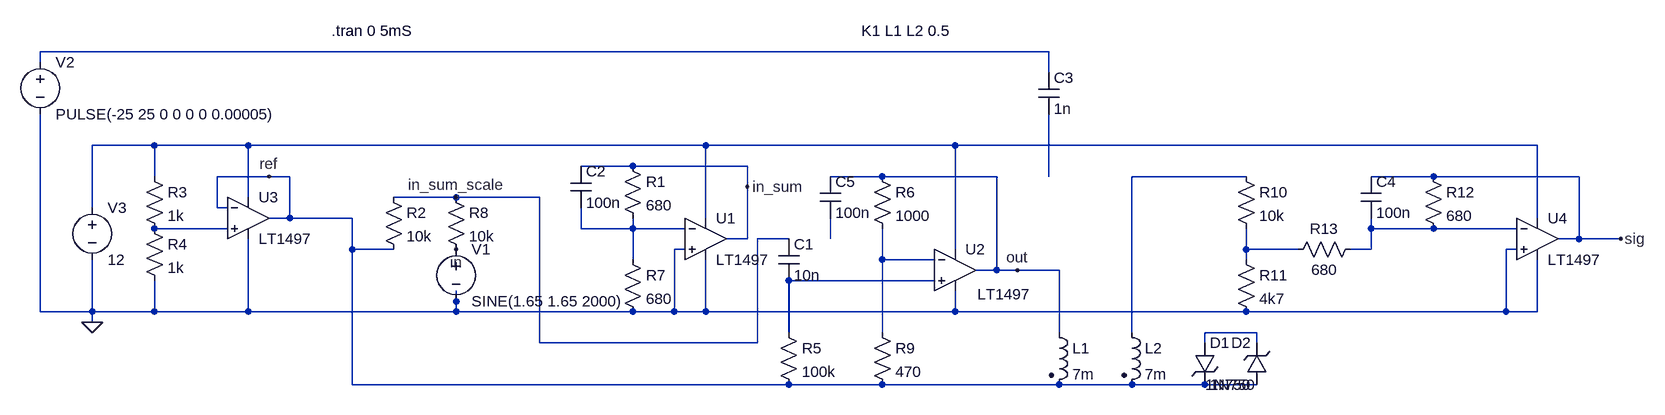
[diagram p0: schematic res2.1.asc]
res2.1.asc, the LTspice schematic file:
Version 4
SHEET 1 3692 680
WIRE 2768 -16 1216 -16
WIRE 1216 0 1216 -16
WIRE 2768 16 2768 -16
WIRE 1392 128 1296 128
WIRE 1536 128 1392 128
WIRE 2240 128 1536 128
WIRE 2624 128 2240 128
WIRE 3520 128 2624 128
WIRE 2128 160 2048 160
WIRE 2304 160 2128 160
WIRE 1392 176 1392 128
WIRE 1568 176 1488 176
WIRE 1600 176 1568 176
WIRE 2512 176 2432 176
WIRE 2688 176 2512 176
WIRE 2768 176 2768 80
WIRE 3072 176 2896 176
WIRE 3360 176 3264 176
WIRE 3584 176 3360 176
WIRE 2304 192 2304 160
WIRE 1536 208 1536 128
WIRE 1856 208 1760 208
WIRE 1984 208 1856 208
WIRE 1296 224 1296 128
WIRE 1488 224 1488 176
WIRE 1504 224 1488 224
WIRE 1600 240 1600 176
WIRE 1600 240 1568 240
WIRE 1696 240 1600 240
WIRE 2240 240 2240 128
WIRE 3520 240 3520 128
WIRE 1504 256 1392 256
WIRE 2048 256 2048 224
WIRE 2128 256 2128 240
WIRE 2128 256 2048 256
WIRE 2208 256 2128 256
WIRE 3264 256 3264 240
WIRE 3360 256 3264 256
WIRE 3488 256 3360 256
WIRE 2304 272 2304 192
WIRE 2304 272 2272 272
WIRE 2368 272 2320 272
WIRE 2432 272 2432 240
WIRE 3584 272 3584 176
WIRE 3584 272 3552 272
WIRE 3648 272 3584 272
WIRE 1696 288 1696 240
WIRE 1760 288 1696 288
WIRE 2208 288 2192 288
WIRE 2624 288 2624 128
WIRE 3072 288 3072 256
WIRE 3152 288 3072 288
WIRE 3264 288 3264 256
WIRE 3264 288 3232 288
WIRE 3488 288 3472 288
WIRE 2128 304 2128 256
WIRE 2512 304 2512 256
WIRE 2592 304 2512 304
WIRE 3072 304 3072 288
WIRE 2688 320 2688 176
WIRE 2688 320 2656 320
WIRE 2720 320 2688 320
WIRE 2784 320 2720 320
WIRE 2592 336 2368 336
WIRE 1856 368 1856 352
WIRE 1216 384 1216 80
WIRE 1296 384 1296 304
WIRE 1296 384 1216 384
WIRE 1392 384 1392 336
WIRE 1392 384 1296 384
WIRE 1536 384 1536 272
WIRE 1536 384 1392 384
WIRE 1856 384 1856 368
WIRE 1856 384 1536 384
WIRE 2128 384 1856 384
WIRE 2192 384 2192 288
WIRE 2192 384 2128 384
WIRE 2240 384 2240 304
WIRE 2240 384 2192 384
WIRE 2624 384 2624 352
WIRE 2624 384 2240 384
WIRE 3072 384 2624 384
WIRE 3472 384 3472 288
WIRE 3472 384 3072 384
WIRE 3520 384 3520 304
WIRE 3520 384 3472 384
WIRE 1296 400 1296 384
WIRE 2368 416 2368 336
WIRE 2512 416 2512 304
WIRE 2784 416 2784 320
WIRE 2896 416 2896 176
WIRE 3088 416 3008 416
WIRE 1984 432 1984 208
WIRE 2320 432 1984 432
WIRE 2320 432 2320 272
WIRE 3008 432 3008 416
WIRE 3088 432 3088 416
WIRE 1696 496 1696 288
WIRE 2368 496 1696 496
WIRE 2512 496 2368 496
WIRE 2784 496 2512 496
WIRE 2896 496 2784 496
WIRE 3008 496 2896 496
WIRE 3088 496 3008 496
FLAG 1296 400 0
FLAG 1568 176 ref
FLAG 1856 208 in_sum_scale
FLAG 1856 288 in
FLAG 2304 192 in_sum
FLAG 2720 320 out
FLAG 3648 272 sig
SYMBOL voltage 1856 272 R0
SYMATTR InstName V1
SYMATTR Value SINE(1.65 1.65 2000)
SYMATTR SpiceLine Rser=1
SYMBOL voltage 1296 208 R0
SYMATTR InstName V3
SYMATTR Value 12
SYMATTR SpiceLine Rser=1
SYMBOL res 1376 160 R0
SYMATTR InstName R3
SYMATTR Value 1k
SYMBOL res 1376 240 R0
SYMATTR InstName R4
SYMATTR Value 1k
SYMBOL res 2112 144 R0
SYMATTR InstName R1
SYMATTR Value 680
SYMBOL Opamps/LT1497 2240 208 R0
SYMATTR InstName U1
SYMBOL ind2 2768 400 R0
SYMATTR InstName L1
SYMATTR Value 7m
SYMATTR Type ind
SYMATTR SpiceLine Rser=30
SYMBOL Opamps/LT1497 2624 256 R0
WINDOW 3 34 101 Left 2
SYMATTR InstName U2
SYMBOL ind2 2880 400 R0
SYMATTR InstName L2
SYMATTR Value 7m
SYMATTR SpiceLine Rser=70
SYMBOL res 2112 288 R0
SYMATTR InstName R7
SYMATTR Value 680
SYMBOL res 1744 192 R0
SYMATTR InstName R2
SYMATTR Value 10k
SYMBOL res 1840 192 R0
SYMATTR InstName R8
SYMATTR Value 10k
SYMBOL res 2352 400 R0
SYMATTR InstName R5
SYMATTR Value 100k
SYMBOL cap 2352 272 R0
SYMATTR InstName C1
SYMATTR Value 10n
SYMBOL res 2496 160 R0
SYMATTR InstName R6
SYMATTR Value 1000
SYMBOL res 2496 400 R0
SYMATTR InstName R9
SYMATTR Value 470
SYMBOL Opamps/LT1497 1536 176 R0
SYMATTR InstName U3
SYMBOL cap 2032 160 R0
SYMATTR InstName C2
SYMATTR Value 100n
SYMBOL res 3056 160 R0
SYMATTR InstName R10
SYMATTR Value 10k
SYMBOL res 3056 288 R0
SYMATTR InstName R11
SYMATTR Value 4k7
SYMBOL voltage 1216 -16 R0
SYMATTR InstName V2
SYMATTR Value PULSE(-25 25 0 0 0 0 0.00005)
SYMATTR SpiceLine Rser=1
SYMBOL cap 2752 16 R0
SYMATTR InstName C3
SYMATTR Value 1n
SYMBOL Opamps/LT1497 3520 208 R0
SYMATTR InstName U4
SYMBOL res 3344 160 R0
SYMATTR InstName R12
SYMATTR Value 680
SYMBOL res 3248 272 R90
WINDOW 0 0 56 VBottom 2
WINDOW 3 32 56 VTop 2
SYMATTR InstName R13
SYMATTR Value 680
SYMBOL cap 3248 176 R0
SYMATTR InstName C4
SYMATTR Value 100n
SYMBOL zener 2992 432 R0
SYMATTR InstName D1
SYMATTR Value 1N750
SYMBOL zener 3104 496 R180
WINDOW 0 24 64 Left 2
WINDOW 3 24 0 Left 2
SYMATTR InstName D2
SYMATTR Value 1N750
SYMBOL cap 2416 176 R0
SYMATTR InstName C5
SYMATTR Value 100n
TEXT 1664 -48 Left 2 !.tran 0 5mS
TEXT 2480 -48 Left 2 !K1 L1 L2 0.5

The netlist it stands for:
* res2.1.asc
V1 in 0 SINE(1.65 1.65 2000) Rser=1
V3 N002 0 12 Rser=1
R3 N002 N005 1k
R4 N005 0 1k
R1 in_sum N006 680
XU1 0 N006 N002 0 in_sum LT1497  ; pins In+ In- V+ V- OUT
L1 out ref 7m Rser=30
XU2 N011 N010 N002 0 out LT1497  ; pins In+ In- V+ V- OUT
L2 N004 ref 7m Rser=70
R7 N006 0 680
R2 in_sum_scale ref 10k
R8 in_sum_scale in 10k
R5 N011 ref 100k
C1 in_sum_scale N011 10n
R6 out N010 1000
R9 N010 ref 470
XU3 N005 ref N002 0 ref LT1497  ; pins In+ In- V+ V- OUT
C2 in_sum N006 100n
R10 N004 N009 10k
R11 N009 0 4k7
V2 N001 0 PULSE(-25 25 0 0 0 0 0.00005) Rser=1
C3 N001 N003 1n
XU4 0 N007 N002 0 sig LT1497  ; pins In+ In- V+ V- OUT
R12 sig N007 680
R13 N007 N009 680
C4 sig N007 100n
D1 N012 ref 1N750
D2 ref N012 1N750
C5 out N008 100n
.model D D
.lib standard.dio
.tran 0 5mS
K1 L1 L2 0.5
.backanno
.end